# Altium project KeyPad.PrjPcb
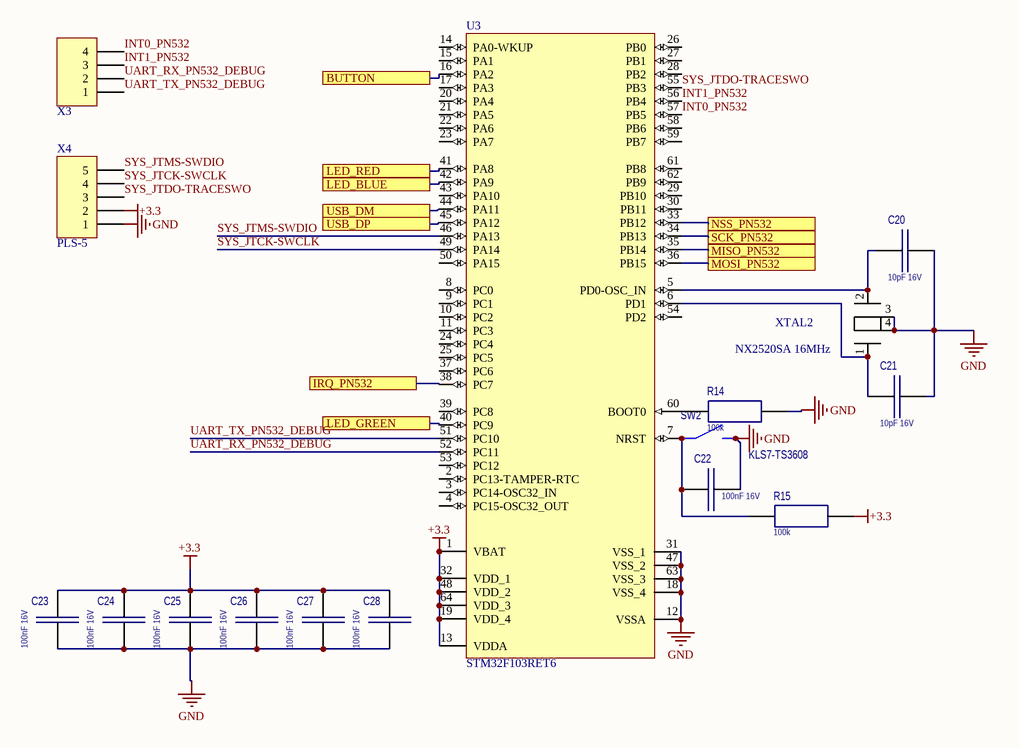
[diagram p0: STM32.SchDoc]
3 sheets, 58 parts. Net scope: flat (ports and power ports of the same name join across sheets).
Board file: PCB1.PcbDoc
Sheets:
  STM32.SchDoc
  pn532.SchDoc
  some_mini_things.SchDoc

## Sheet STM32.SchDoc
size A4

### Parts
C20  10pF 16V  [C_0805]
C21  10pF 16V  [C_0805]
C22  100nF 16V  [C_0805]
C23  100nF 16V  [C_0805]
C24  100nF 16V  [C_0805]
C25  100nF 16V  [C_0805]
C26  100nF 16V  [C_0805]
C27  100nF 16V  [C_0805]
C28  100nF 16V  [C_0805]
R14  100k  [R_0805]
R15  100k  [R_0805]
SW2  KLS7-TS3608  [KLS7-TS3611]
U3  STM32F103RET6  [LQFP64_L]
X3  PLS-4  [PLS-4-3D]  (value not drawn)
X4  PLS-5  [PLS-5-3D]
XTAL2  NX2520SA 16MHz  [NX2520SA]

### Ports
BUTTON, IRQ_PN532, LED_BLUE, LED_GREEN, LED_RED, MISO_PN532, MOSI_PN532, NSS_PN532, SCK_PN532, USB_DM, USB_DP

### Nets
+3.3: C23.1 C24.1 C25.1 C26.1 C27.1 C28.1 R15.1 U3.1(VBAT) U3.13(VDDA) U3.19(VDD_4) U3.32(VDD_1) U3.48(VDD_2) U3.64(VDD_3) X4.2
GND: C20.1 C21.1 C22.1 C23.2 C24.2 C25.2 C26.2 C27.2 C28.2 R14.1 SW2.2 U3.12(VSSA) U3.18(VSS_4) U3.31(VSS_1) U3.47(VSS_2) U3.63(VSS_3) X4.1 XTAL2.3 XTAL2.4
INT0_PN532: U3.57(PB5) X3.4
INT1_PN532: U3.56(PB4) X3.3
SYS_JTCK-SWCLK: U3.49(PA14) X4.4
SYS_JTDO-TRACESWO: U3.55(PB3) X4.3
SYS_JTMS-SWDIO: U3.46(PA13) X4.5
UART_RX_PN532_DEBUG: U3.52(PC11) X3.2
UART_TX_PN532_DEBUG: U3.51(PC10) X3.1
NetC19_1: U3.16(PA2) ; port BUTTON
NetC20_2: C20.2 U3.5(PD0-OSC_IN) XTAL2.2
NetC21_2: C21.2 U3.6(PD1) XTAL2.1
NetC22_2: C22.2 R15.2 SW2.1 U3.7(NRST)
NetR6_1: U3.40(PC9) ; port LED_GREEN
NetR7_1: U3.41(PA8) ; port LED_RED
NetR8_1: U3.42(PA9) ; port LED_BLUE
NetR10_2: U3.44(PA11) ; port USB_DM
NetR11_2: U3.45(PA12) ; port USB_DP
NetR14_2: R14.2 U3.60(BOOT0)
NetU1_25: U3.38(PC7) ; port IRQ_PN532
NetU1_27: U3.33(PB12) ; port NSS_PN532
NetU1_28: U3.36(PB15) ; port MOSI_PN532
NetU1_29: U3.35(PB14) ; port MISO_PN532
NetU1_30: U3.34(PB13) ; port SCK_PN532

Not connected (* = marked no-connect by the designer): U3 2(PC13-TAMPER-RTC) 3(PC14-OSC32_IN) 4(PC15-OSC32_OUT) 8(PC0) 9(PC1) 10(PC2) 11(PC3) 14(PA0-WKUP) 15(PA1) 17(PA3) 20(PA4) 21(PA5) 22(PA6) 23(PA7) 24(PC4) 25(PC5) 26(PB0) 27(PB1) 28(PB2) 29(PB10) 30(PB11) 37(PC6) 39(PC8) 43(PA10) 50(PA15) 53(PC12) 54(PD2) 58(PB6) 59(PB7) 61(PB8) 62(PB9)

### Library data of the parts
C20-C28 = C0805: Capacitor
  C20 C21: Value: 10pF 16V
  C22-C28: Value: 100nF 16V
R14 R15 = R0805: Resistor; Value: 100k
SW2 = button
U3 = STM32F103RET6: STM32 ARM-based 32-bit MCU Performance Line with 512 kB Flash, 64 kB Internal RAM, -40 to +85°C Temperature, 64-Pin LQFP, Tray; DatasheetVersion: rev8.0, Apr-2011; PackageVersion: rev13, Apr-2011; PackageReference: LQFP64; PackageDescription: 64-Pin Low-Profile Quad Flat Pack, 10 x 10 mm Body, 0.5 mm Pitch (LQFP64); ComponentLink1Description: Manufacturer URL; ComponentLink1URL: http://www.st.com/; ComponentLink2Description: STM32F103 Datasheet; ComponentLink2URL: http://www.st.com/internet/com/TECHNICAL_RESOURCES/TECHNICAL_LITERATURE/DATASHEET/CD00191185.pdf; ComponentLink3Description: STM32 Family Web Page; ComponentLink3URL: www.st.com/stm32
X3 = PLS-4: Header, 4-Pin; LatestRevisionDate: 17-Jul-2002; LatestRevisionNote: Re-released for DXP Platform.; Publisher: Altium Limited
X4 = PLS-5: Header, 5-Pin; LatestRevisionDate: 17-Jul-2002; LatestRevisionNote: Re-released for DXP Platform.; Publisher: Altium Limited
XTAL2 = NX2520SA: Quartz; pin to pad: 2>3 3>2

## Sheet pn532.SchDoc
size A4
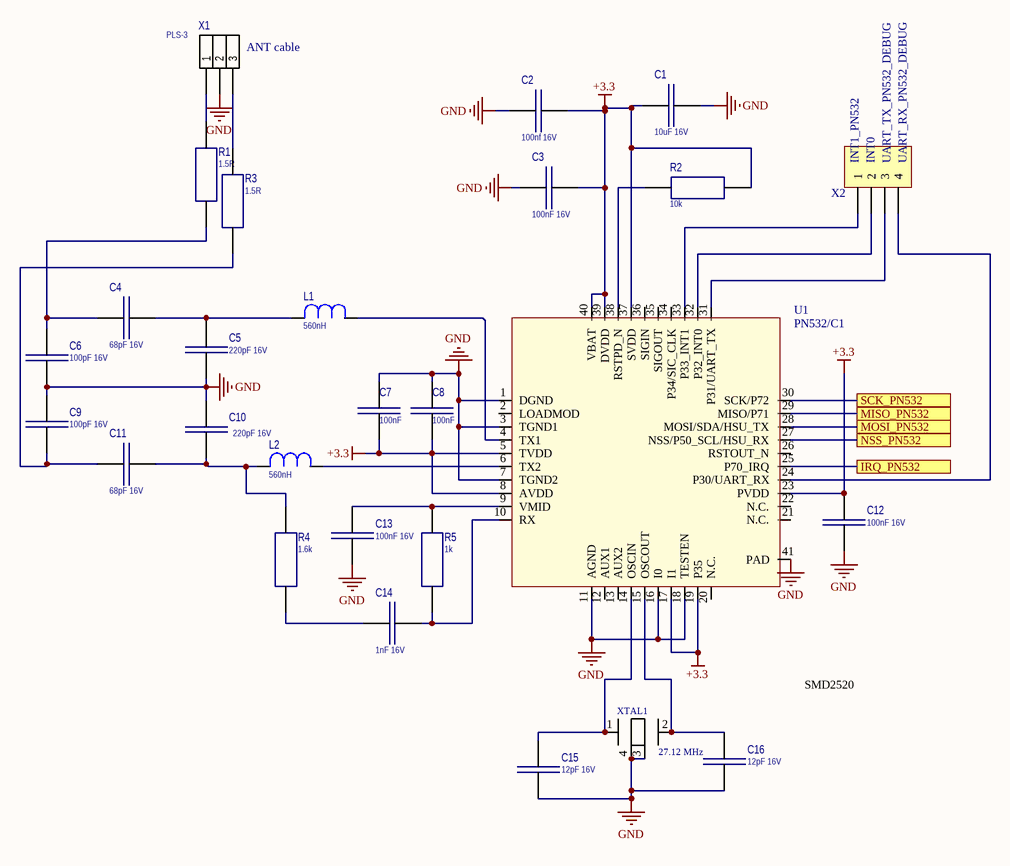
[diagram p1: pn532.SchDoc]

### Parts
C1  10uF 16V  [C_0805]
C2  100nf 16V  [C_0805]
C3  100nF 16V  [C_0805]
C4  68pF 16V  [C_0805]
C5  220pF 16V  [C_0805]
C6  100pF 16V  [C_0805]
C7  100nF  [C_0805]
C8  100nF  [C_0805]
C9  100pF 16V  [C_0805]
C10  220pF 16V  [C_0805]
C11  68pF 16V  [C_0805]
C12  100nF 16V  [C_0805]
C13  100nF 16V  [C_0805]
C14  1nF 16V  [C_0805]
C15  12pF 16V  [C_0805]
C16  12pF 16V  [C_0805]
L1  560nH  [L_0805]
L2  560nH  [L_0805]
R1  1.5R  [R_0805]
R2  10k  [R_0805]
R3  1.5R  [R_0805]
R4  1.6k  [R_0805]
R5  1k  [R_0805]
U1  PN532/C1  [NXP-HVQFN-40_L]
X1  PLS-3  [PLS-3-3D]
X2  PLS-4  [PLS-4-3D]  (value not drawn)
XTAL1  27.12 MHz  [NX2520SA]

### Ports
IRQ_PN532, MISO_PN532, MOSI_PN532, NSS_PN532, SCK_PN532

### Nets
+3.3: C1.2 C2.1 C3.1 C7.1 C8.1 C12.2 R2.1 U1.5(TVDD) U1.8(AVDD) U1.17(I1) U1.19(P35) U1.23(PVDD) U1.37(SVDD) U1.39(DVDD) U1.40(VBAT)
GND: C1.1 C2.2 C3.2 C5.1 C6.1 C7.2 C8.2 C9.2 C10.2 C12.1 C13.1 C15.1 C16.1 U1.1(DGND) U1.3(TGND1) U1.7(TGND2) U1.11(AGND) U1.16(I0) U1.18(TESTEN) U1.41(PAD) X1.2 XTAL1.3 XTAL1.4
NetC4_1: C4.1 C5.2 L1.1
NetC4_2: C4.2 C6.2 R1.1
NetC9_1: C9.1 C11.2 R3.1
NetC10_1: C10.1 C11.1 L2.1 R4.2
NetC13_2: C13.2 R5.2 U1.9(VMID)
NetC14_1: C14.1 R5.1 U1.10(RX)
NetC14_2: C14.2 R4.1
NetC15_2: C15.2 U1.14(OSCIN) XTAL1.1
NetC16_2: C16.2 U1.15(OSCOUT) XTAL1.2
NetL1_2: L1.2 U1.4(TX1)
NetL2_2: L2.2 U1.6(TX2)
NetR1_2: R1.2 X1.1
NetR2_2: R2.2 U1.38(RSTPD_N)
NetR3_2: R3.2 X1.3
NetU1_24: U1.24(P30/UART_RX) X2.4
NetU1_25: U1.25(P70_IRQ) ; port IRQ_PN532
NetU1_27: U1.27(NSS/P50_SCL/HSU_RX) ; port NSS_PN532
NetU1_28: U1.28(MOSI/SDA/HSU_TX) ; port MOSI_PN532
NetU1_29: U1.29(MISO/P71) ; port MISO_PN532
NetU1_30: U1.30(SCK/P72) ; port SCK_PN532
NetU1_31: U1.31(P31/UART_TX) X2.3
NetU1_32: U1.32(P32_INT0) X2.2
NetU1_33: U1.33(P33_INT1) X2.1

Not connected (* = marked no-connect by the designer): U1 2(LOADMOD) 12(AUX1) 13(AUX2) 20(N.C.) 21(N.C.) 22(N.C.) 26(RSTOUT_N) 34(P34/SIC_CLK) 35(SIGOUT) 36(SIGIN)

### Notes on the sheet
- (near X1) ANT cable
- (near X2) INT1_PN532
- (near X2) INT0
- (near X2) UART_TX_PN532_DEBUG
- (near X2) UART_RX_PN532_DEBUG
- SMD2520

### Library data of the parts
C1-C16 = C0805: Capacitor
  C1: Value: 10uF 16V
  C2: Value: 100nf 16V
  C3 C12 C13: Value: 100nF 16V
  C4 C11: Value: 68pF 16V
  C5 C10: Value: 220pF 16V
  C6 C9: Value: 100pF 16V
  C7 C8: Value: 100nF
  C14: Value: 1nF 16V
  C15 C16: Value: 12pF 16V
L1 L2 = L0805: MLF2012DR56K; Value: 560nH
R1-R5 = R0805: Resistor
  R1 R3: Value: 1.5R
  R2: Value: 10k
  R4: Value: 1.6k
  R5: Value: 1k
X1 = PLS-3: Header, 3-Pin; LatestRevisionDate: 17-Jul-2002; LatestRevisionNote: Re-released for DXP Platform.; Publisher: Altium Limited
X2 = PLS-4: Header, 4-Pin; LatestRevisionDate: 17-Jul-2002; LatestRevisionNote: Re-released for DXP Platform.; Publisher: Altium Limited
XTAL1 = NX2520SA: Quartz; pin to pad: 2>3 3>2

## Sheet some_mini_things.SchDoc
size A4
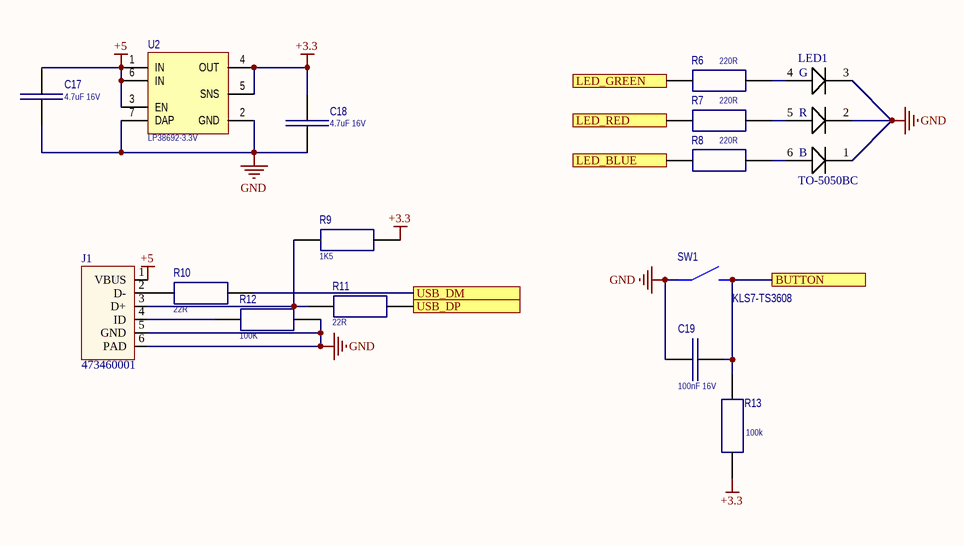
[diagram p2: some_mini_things.SchDoc]

### Parts
C17  4.7uF 16V  [C_0805]
C18  4.7uF 16V  [C_0805]
C19  100nF 16V  [C_0805]
J1  473460001  [micro-USB]
LED1  TO-5050BC  [TO-5050BC]
R6  220R  [R_0805]
R7  220R  [R_0805]
R8  220R  [R_0805]
R9  1K5  [R_0805]
R10  22R  [R_0805]
R11  22R  [R_0805]
R12  100K  [R_0805]
R13  100k  [R_0805]
SW1  KLS7-TS3608  [KLS7-TS3611]
U2  LP38692-3.3V  [WSON-6]

### Ports
BUTTON, LED_BLUE, LED_GREEN, LED_RED, USB_DM, USB_DP

### Nets
+3.3: C18.2 R9.2 R13.1 U2.4(OUT) U2.5(SNS)
+5: C17.2 J1.1(VBUS) U2.1(IN) U2.3(EN) U2.6(IN)
GND: C17.1 C18.1 C19.2 J1.5(GND) J1.6(PAD) LED1.1 LED1.2 LED1.3 R12.2 SW1.1 U2.2(GND) U2.7(DAP)
NetC19_1: C19.1 R13.2 SW1.2 ; port BUTTON
NetJ1_2: J1.2(D-) R10.1
NetJ1_3: J1.3(D+) R9.1 R11.1
NetJ1_4: J1.4(ID) R12.1
NetLED1_4: LED1.4 R6.2
NetLED1_5: LED1.5 R7.2
NetLED1_6: LED1.6 R8.2
NetR6_1: R6.1 ; port LED_GREEN
NetR7_1: R7.1 ; port LED_RED
NetR8_1: R8.1 ; port LED_BLUE
NetR10_2: R10.2 ; port USB_DM
NetR11_2: R11.2 ; port USB_DP

### Notes on the sheet
- (in symbol TO-5050BC) G; R; B

### Library data of the parts
C17-C19 = C0805: Capacitor
  C17 C18: Value: 4.7uF 16V
  C19: Value: 100nF 16V
J1 = MICRO-USB: molex 473460001
LED1 = TO-5050BC: RGB led
R6-R13 = R0805: Resistor
  R6-R8: Value: 220R
  R9: Value: 1K5
  R10 R11: Value: 22R
  R12: Value: 100K
  R13: Value: 100k
SW1 = button
U2 = LP38692: LP38690, LP38692 1-A LDO CMOS Linear Regulators  Stable with Ceramic Output Capacitors

## Nets that join several sheets
+3.3: STM32 (14 pins), pn532 (15 pins), some_mini_things (5 pins)
GND: STM32 (19 pins), pn532 (23 pins), some_mini_things (12 pins)
NetC19_1: STM32 (U3.16), some_mini_things (C19.1 R13.2 SW1.2)
NetR6_1: STM32 (U3.40), some_mini_things (R6.1)
NetR7_1: STM32 (U3.41), some_mini_things (R7.1)
NetR8_1: STM32 (U3.42), some_mini_things (R8.1)
NetR10_2: STM32 (U3.44), some_mini_things (R10.2)
NetR11_2: STM32 (U3.45), some_mini_things (R11.2)
NetU1_25: STM32 (U3.38), pn532 (U1.25)
NetU1_27: STM32 (U3.33), pn532 (U1.27)
NetU1_28: STM32 (U3.36), pn532 (U1.28)
NetU1_29: STM32 (U3.35), pn532 (U1.29)
NetU1_30: STM32 (U3.34), pn532 (U1.30)